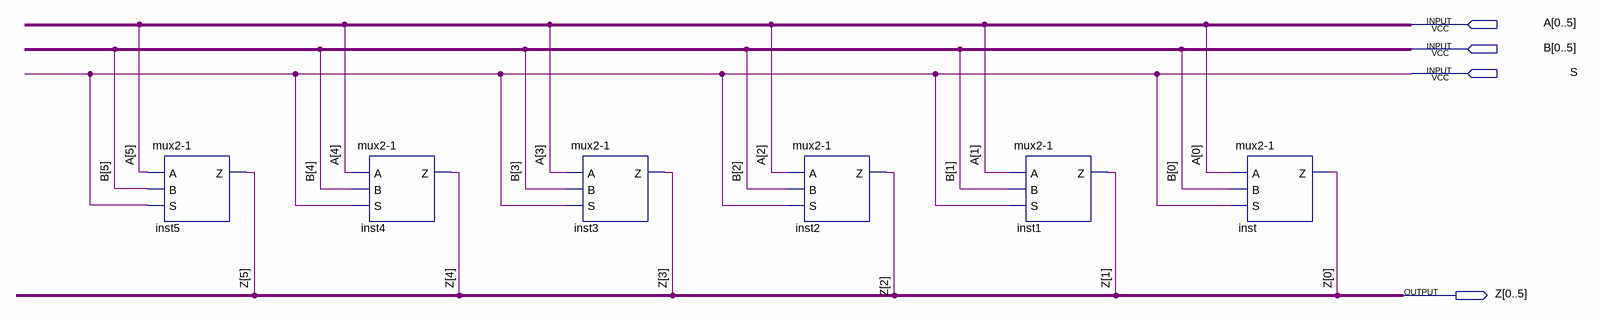
[diagram p0: schematic sheet]
// Quartus schematic mux-2-1_6bit.bdf as structural Verilog: 6 symbols, 4 pins
module \mux-2-1_6bit  (
  input  [0:5] A,
  input  [0:5] B,
  input  S,
  output [0:5] Z
);

  \mux2-1  inst5 (.A(A[5]), .B(B[5]), .S(S), .Z(Z[5]));
  \mux2-1  inst4 (.A(A[4]), .B(B[4]), .S(S), .Z(Z[4]));
  \mux2-1  inst3 (.A(A[3]), .B(B[3]), .S(S), .Z(Z[3]));
  \mux2-1  inst2 (.A(A[2]), .B(B[2]), .S(S), .Z(Z[2]));
  \mux2-1  inst1 (.A(A[1]), .B(B[1]), .S(S), .Z(Z[1]));
  \mux2-1  inst (.A(A[0]), .B(B[0]), .S(S), .Z(Z[0]));
endmodule
